# Altium schematic sheet [01].HMS.Power.SchDoc
size A4; SheetNumber: 2; SheetTotal: 7
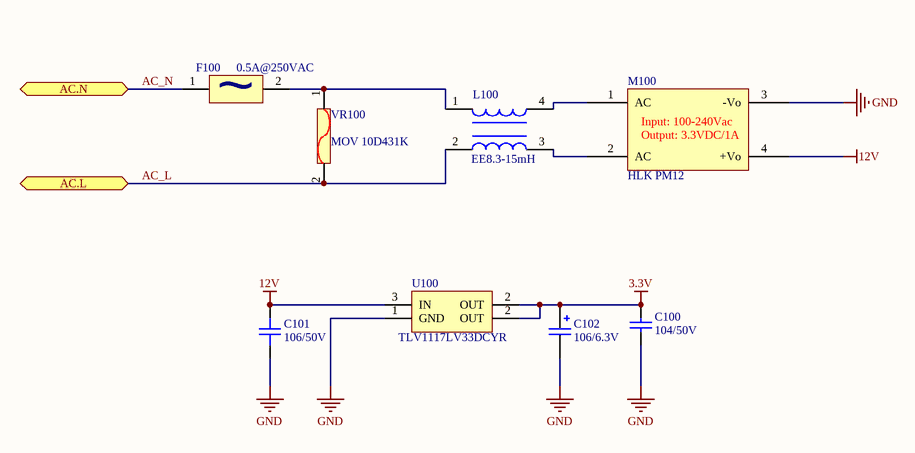
[diagram p0: [01].HMS.Power.SchDoc]

## Parts
C100  104/50V  [CAP_CERAMIC_0402(1005)]
C101  106/50V  [CAP_CERAMIC_1206(3216-18)]
C102  106/6.3V  [CAP_TANTAL_1206(3216-18)]
F100  0.5A@250VAC  [RUEF250U-2]
L100  EE8.3-15mH  [EE8.3-15mH]
M100  HLK PM12  [HLK PW03]
U100  TLV1117LV33DCYR  [LM1117-SOP]
VR100  MOV 10D431K  [MOV 10D431K]

## Ports
AC.L (bidir), AC.N (bidir)

## Nets
3.3V: C100.2 C102.1 U100.2(OUT)
12V: C101.1 M100.4(+Vo) U100.3(IN)
GND: C100.1 C101.2 C102.2 M100.3(-Vo) U100.1(GND)
AC_L: L100.2 VR100.2 ; port AC.L
AC_N: F100.1 ; port AC.N
NetF100_2: F100.2 L100.1 VR100.1
NetL100_3: L100.3 M100.2(AC)
NetL100_4: L100.4 M100.1(AC)

## Notes on the sheet
- (in symbol HLK PM03) Input: 100-240Vac; Output: 3.3VDC/1A
- (in symbol RUEF250U-2) ~

## Library data of the parts
C100 = Cap: CAP CER 0.1UF 50V X5R 0402; MPN: CC0402KRX5R9BB104; MFR: YAGEO; Published: 8-Jun-2000; LatestRevisionDate: 17-Jul-2002; LatestRevisionNote: Re-released for DXP Platform.; PackageReference: RAD-0.3; Publisher: Altium Limited; Value: 104/50V; Category: Ceramic Capacitors
C101 = CL21A106KOQNNNE: CAP Ceramic 106/16V 10% 1206; MPN: CL31A106KOHNNNE; CompanyID: VT-00018; Solder: SMT; Value: 106/50V; Category: CAPACITOR
C102 = UWT1C221MCL1GS: CAP Tantal 10uF/6.3V 10% 1206; MFR: Nichicon; MPN: 293D106X96R3A2TE3; Capacitance: 220µF; Voltage Rating: 6.3V; Tolerance: ±20%; Lifetime @ Temp.: 1000 Hrs @ 105°C; Ripple Current: 105mA; Surface Mount Land Size: 0.260" L x 0.260" W (6.60mm x 6.60mm); MP: TAJB106K006SNJ; Supplier 1: Digi-Key; RoHS: RoHS Compliant; Category: Capacitors; Stock 1: 45106; Pricing 1: 1=0.46, 10=0.366, 100=0.2205, 250=0.16536 (USD); Operating Temperature: -55°C ~ 105°C; Features: General Purpose; ESR (Equivalent Series Resistance): -; Impedance: -; Mounting Type: Surface Mount; Package / Case: Radial, Can - SMD; Size / Dimension: 0.248" Dia (6.30mm); Height - Seated (Max): 0.303" (7.70mm); Lead Spacing: -; Packaging: Cut Tape (CT); ComponentLink1URL: http://www.nichicon.co.jp/english/products/pdfs/e-wt.pdf; ComponentLink1Description: http://www.nichicon.co.jp/english/products/pdfs/e-wt.pdf; Supplier Part Number 1: 493-2179-1-ND; Value: 106/6.3V
F100 = RUEF250U-2: Cầu chì tự phục hồi 0.5A 250V; Manufacturer: Bourns; Manufacturer Part Number: MF-RX250/72-2; MPN: TRF250-500; Resistance: 0.08 Ohms; Type: PTC Resettable Fuses; Voltage Rating AC: 72 V; Current Rating (Max): 40 A; Hold Current: 2.5 A; Maximum Voltage: 72 VDC; Trip Current: 5 A; NPN: TRF250-500 DIP; Supplier 1: Mouser; RoHS: RoHS Compliant; Category: Resettable Fuses; Stock 1: 0; Pricing 1: 1=0.648, 10=0.518, 100=0.392, 250=0.352, 500=0.333, 1000=0.284, 5000=0.265, 10000=0.239 (AUD); Dimensions: 17.84 mm L x 3.1 mm W x 23.84 mm  H x 17.84 mm D; Operating Temperature Range: - 40 C to + 85 C; Packaging: Reel; Series: MF-RX/72; Termination Style: Radial; Mounting Style: Through Hole; Lead Spacing: 10.2 mm; Maximum Voltage DC: 72 V; Product Category: Radial Lead Resettable Fuses; Standard Pack Qty: 1000; RoHS - Mouser: Y; Minimum Order Quantity: 1; Reeling: True; ComponentLink1URL: http://www.bourns.com/data/global/pdfs/mfr72.pdf; ComponentLink1Description: http://www.bourns.com/data/global/pdfs/mfr72.pdf; Supplier Part Number 1: 652-MF-RX250/72-2; Value: 0.5A@250VAC
L100 = EE8.3-15mH: Cuộn lọc 15mH EE8.3; MPN: EE8.3-15mH
M100 = HLK PM03: Module Power AC Convertor DC 220VAC - 12VDC; MPN: HLKPM03
U100 = REG1117-3.3: 800mA and 1A Low Dropout Positive Regulator 3.3V; Published: 8-Jun-2000; LatestRevisionDate: 17-Jul-2002; LatestRevisionNote: Re-released for DXP Platform.; DatasheetVersion: Sep-1997; PackageVersion: revC; PackageReference: ZZ311; Publisher: Altium Limited; PackageDescription: SOT-223/SC-73; 4 Leads; Body 6.7 x 7.3 mm, inc. leads (LxW max); ComponentLink1Description: Manufacturer Link; ComponentLink1URL: http://www.ti.com/; ComponentLink2Description: Datasheet; ComponentLink2URL: http://www-s.ti.com/sc/ds/REG1117.pdf; Value: TLV1117LV33DCYR; MPN: TLV1117LV33DCYR
VR100 = Varistor 10D431K: Varistor 10D431K 430V 10mm; MPN: 10D431K